# EAGLE schematic V1 (EAGLE 9.1.3)
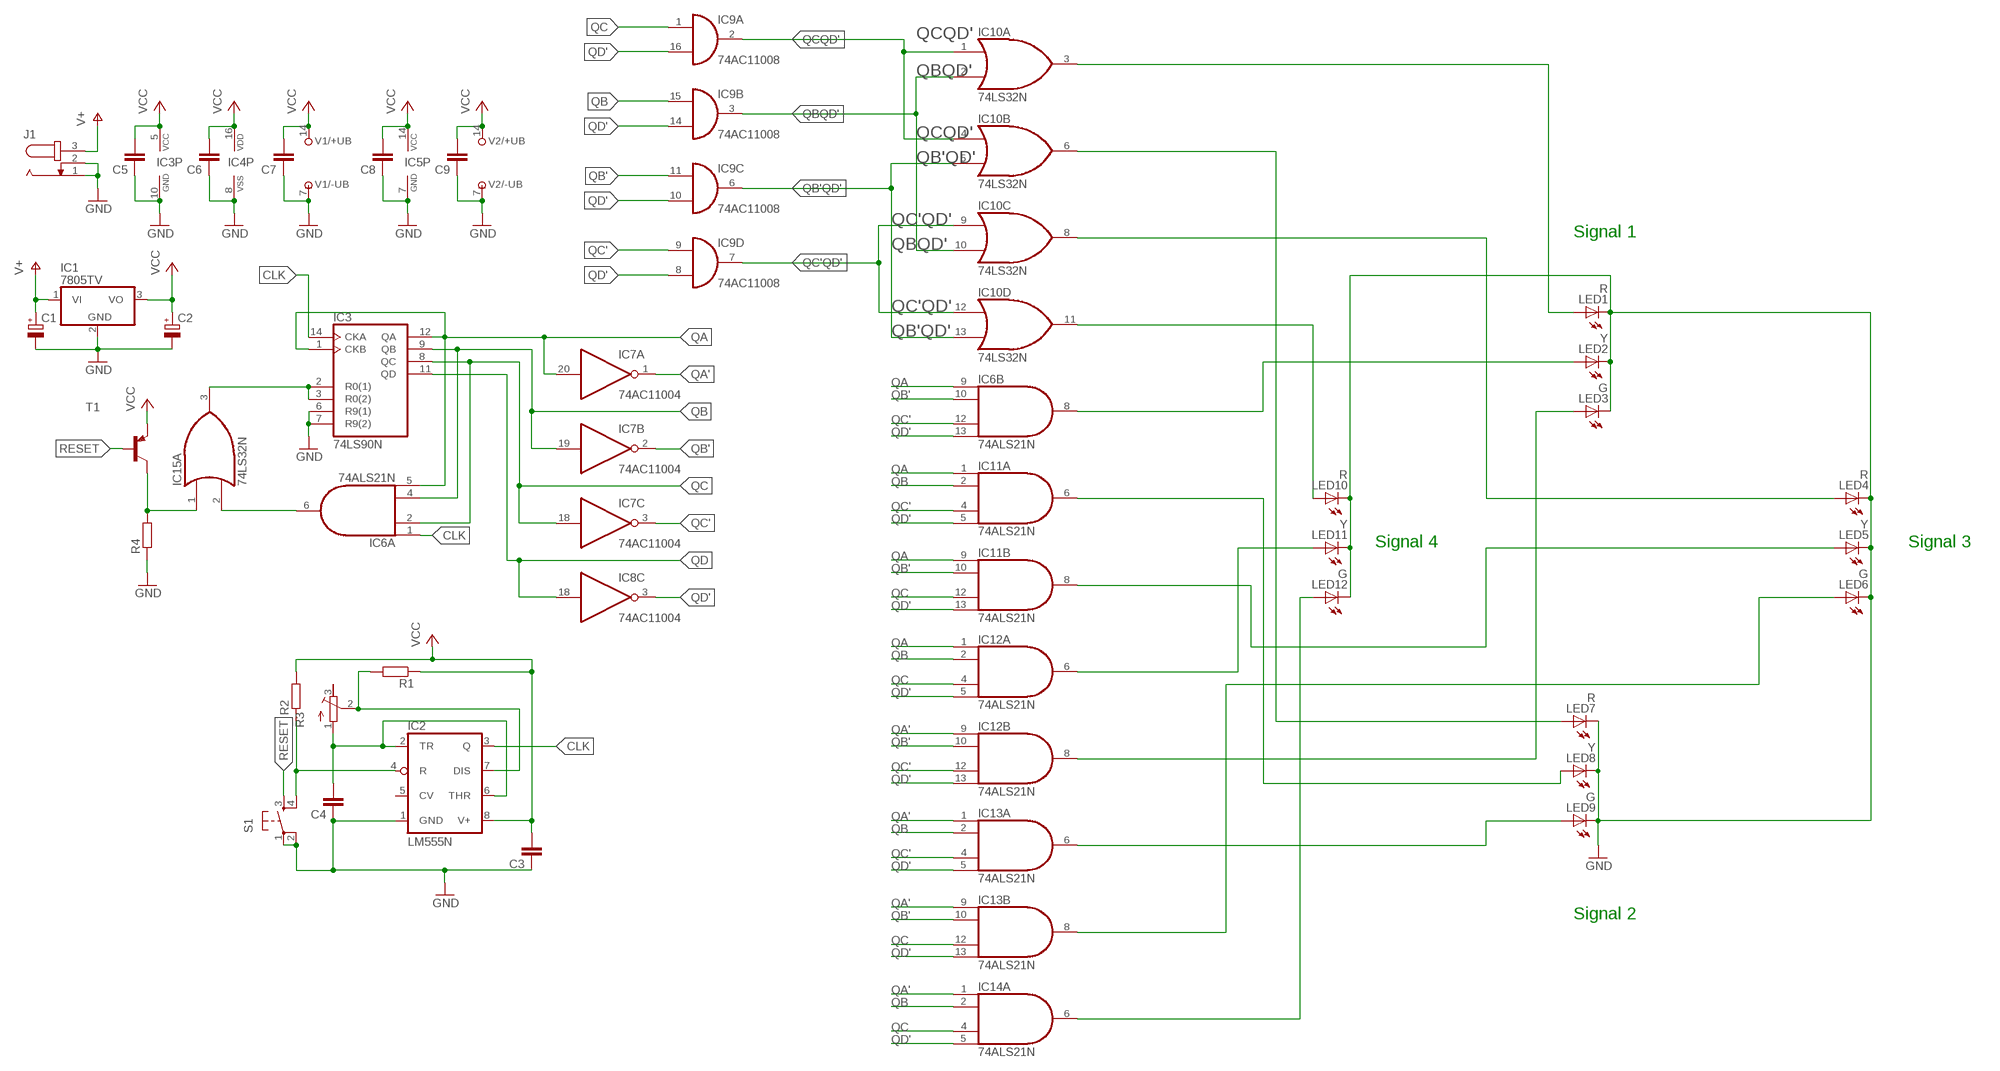
[diagram p0: schematic, sheet 1]

## Parts
C1  CPOL-EUE3.5-8  [E3,5-8]
C2  CPOL-EUE3.5-8  [E3,5-8]
C3  C-EU050-035X075  [C050-035X075]
C4  C-EU050-035X075  [C050-035X075]
C5  C-EU050-035X075  [C050-035X075]
C6  C-EU050-035X075  [C050-035X075]
C7  C-EU050-035X075  [C050-035X075]
C8  C-EU050-035X075  [C050-035X075]
C9  C-EU050-035X075  [C050-035X075]
IC1  7805TV  [TO220V]
IC2  LM555N  [DIL08]
IC3  74LS90N  [DIL14]
IC4  4028N  [DIL16]
IC5  74AC04N  [DIL14]
IC6  74ALS21N  [DIL14]
IC7  74AC11004  [DIL20]
IC8  74AC11004  [DIL20]
IC9  74AC11008  [DIL16]
IC10  74LS32N  [DIL14]
IC11  74ALS21N  [DIL14]
IC12  74ALS21N  [DIL14]
IC13  74ALS21N  [DIL14]
IC14  74ALS21N  [DIL14]
IC15  74LS32N  [DIL14]
J1  JACK-PLUG0  [SPC4077]
LED1  R  LED5MM  [LED5MM]
LED2  Y  LED5MM  [LED5MM]
LED3  G  LED5MM  [LED5MM]
LED4  R  LED5MM  [LED5MM]
LED5  Y  LED5MM  [LED5MM]
LED6  G  LED5MM  [LED5MM]
LED7  R  LED5MM  [LED5MM]
LED8  Y  LED5MM  [LED5MM]
LED9  G  LED5MM  [LED5MM]
LED10  R  LED5MM  [LED5MM]
LED11  Y  LED5MM  [LED5MM]
LED12  G  LED5MM  [LED5MM]
R1  R-EU_0207/7  [0207/7]
R2  R-EU_0207/7  [0207/7]
R3  R-TRIMM3296W  [RTRIM3296W]
R4  R-EU_0207/7  [0207/7]
S1  TAC_SWITCHPTH  [TACTILE-PTH]
T1  -PNP-TO92/  [TO92/]
V1  7432N  [DIL14]
V2  7432N  [DIL14]

## Nets
CLK: IC2.3(Q) IC3.14(CKA) IC6.1(A:I0)
GND: C1.- C2.- C3.1 C4.1 C5.1 C6.1 C7.1 C8.1 C9.1 IC1.2(GND) IC2.1(GND) IC3.6(R9(1)) IC3.7(R9(2)) IC3.10(GND) IC4.8(VSS) IC5.7(P:GND) J1.1 J1.2 LED1.K(C) LED2.K(C) LED3.K(C) LED4.K(C) LED5.K(C) LED6.K(C) LED7.K(C) LED8.K(C) LED9.K(C) LED10.K(C) LED11.K(C) LED12.K(C) R4.1 S1.1 S1.2 V1.7(/-UB:-UB) V2.7(/-UB:-UB)
N$1: IC2.4(R) R2.1 S1.4
N$2: C4.2 IC2.2(TR) IC2.6(THR) R3.1(A)
N$3: IC10.3(A:O) LED1.A
N$4: IC15.1(A:I0) R4.2 T1.3(C)
N$5: IC10.6(B:O) LED7.A
N$6: IC10.8(C:O) LED4.A
N$7: IC2.7(DIS) R1.2 R3.2(S)
N$8: IC10.11(D:O) LED10.A
N$9: IC6.8(B:O) LED2.A
N$10: IC11.6(A:O) LED8.A
N$11: IC11.8(B:O) LED5.A
N$12: IC12.6(A:O) LED11.A
N$13: IC12.8(B:O) LED3.A
N$14: IC13.6(A:O) LED9.A
N$15: IC13.8(B:O) LED6.A
N$16: IC14.6(A:O) LED12.A
N$17: IC6.6(A:O) IC15.2(A:I1)
N$18: IC3.2(R0(1)) IC3.3(R0(2)) IC15.3(A:O)
QA: IC3.1(CKB) IC3.12(QA) IC6.5(A:I3) IC6.9(B:I0) IC7.20(A:I) IC11.1(A:I0) IC11.9(B:I0) IC12.1(A:I0)
QA': IC7.1(A:O) IC12.9(B:I0) IC13.1(A:I0) IC13.9(B:I0) IC14.1(A:I0)
QB: IC3.9(QB) IC6.4(A:I2) IC7.19(B:I) IC9.15(B:I0) IC11.2(A:I1) IC12.2(A:I1) IC13.2(A:I1) IC14.2(A:I1)
QB': IC6.10(B:I1) IC7.2(B:O) IC9.11(C:I0) IC11.10(B:I1) IC12.10(B:I1) IC13.10(B:I1)
QB'QD': IC9.6(C:O) IC10.5(B:I1) IC10.13(D:I1)
QBQD': IC9.3(B:O) IC10.2(A:I1) IC10.10(C:I1)
QC: IC3.8(QC) IC6.2(A:I1) IC7.18(C:I) IC9.1(A:I0) IC11.12(B:I2) IC12.4(A:I2) IC13.12(B:I2) IC14.4(A:I2)
QC': IC6.12(B:I2) IC7.3(C:O) IC9.9(D:I0) IC11.4(A:I2) IC12.12(B:I2) IC13.4(A:I2)
QC'QD': IC9.7(D:O) IC10.9(C:I0) IC10.12(D:I0)
QCQD': IC9.2(A:O) IC10.1(A:I0) IC10.4(B:I0)
QD: IC3.11(QD) IC8.18(C:I)
QD': IC6.13(B:I3) IC8.3(C:O) IC9.8(D:I1) IC9.10(C:I1) IC9.14(B:I1) IC9.16(A:I1) IC11.5(A:I3) IC11.13(B:I3) IC12.5(A:I3) IC12.13(B:I3) IC13.5(A:I3) IC13.13(B:I3) IC14.5(A:I3)
RESET: S1.3 T1.2(B)
V+: C1.+ IC1.1(VI) J1.3
VCC: C2.+ C3.2 C5.2 C6.2 C7.2 C8.2 C9.2 IC1.3(VO) IC2.8(V+) IC3.5(VCC) IC4.16(VDD) IC5.14(P:VCC) R1.1 R2.2 T1.1(E) V1.14(/+UB:+UB) V2.14(/+UB:+UB)
Unconnected: IC2.5(CV) IC4.1(Q4) IC4.2(Q2) IC4.3(Q0) IC4.4(Q7) IC4.5(Q9) IC4.6(Q5) IC4.7(Q6) IC4.9(Q8) IC4.10(A) IC4.11(D) IC4.12(C) IC4.13(B) IC4.14(Q1) IC4.15(Q3) IC5.1(A:I) IC5.2(A:O) IC5.3(B:I) IC5.4(B:O) IC5.5(C:I) IC5.6(C:O) IC5.8(D:O) IC5.9(D:I) IC5.10(E:O) IC5.11(E:I) IC5.12(F:O) IC5.13(F:I) IC7.8(D:O) IC7.9(E:O) IC7.10(F:O) IC7.11(F:I) IC7.12(E:I) IC7.13(D:I) IC8.1(A:O) IC8.2(B:O) IC8.8(D:O) IC8.9(E:O) IC8.10(F:O) IC8.11(F:I) IC8.12(E:I) IC8.13(D:I) IC8.19(B:I) IC8.20(A:I) IC14.8(B:O) IC14.9(B:I0) IC14.10(B:I1) IC14.12(B:I2) IC14.13(B:I3) IC15.4(B:I0) IC15.5(B:I1) IC15.6(B:O) IC15.8(C:O) IC15.9(C:I0) IC15.10(C:I1) IC15.11(D:O) IC15.12(D:I0) IC15.13(D:I1) R3.3(E) V1.1(/1:A) V1.2(/1:B) V1.3(/1:Y) V1.4(/2:A) V1.5(/2:B) V1.6(/2:Y) V1.8(/3:Y) V1.9(/3:A) V1.10(/3:B) V1.11(/4:Y) V1.12(/4:A) V1.13(/4:B) V2.1(/1:A) V2.2(/1:B) V2.3(/1:Y) V2.4(/2:A) V2.5(/2:B) V2.6(/2:Y) V2.8(/3:Y) V2.9(/3:A) V2.10(/3:B) V2.11(/4:Y) V2.12(/4:A) V2.13(/4:B)

## Notes on the sheet
- Signal 1
- Signal 4 | Signal 3
- Signal 2

## Power pins joined to a net without a drawn wire
GND: IC6.7(P:GND) IC7.4(P:GND) IC7.5(P:GND) IC7.6(P:GND) IC7.7(P:GND) IC8.4(P:GND) IC8.5(P:GND) IC8.6(P:GND) IC8.7(P:GND) IC9.4(P:GND) IC9.5(P:GND) IC10.7(P:GND) IC11.7(P:GND) IC12.7(P:GND) IC13.7(P:GND) IC14.7(P:GND) IC15.7(P:GND)
VCC: IC6.14(P:VCC) IC7.15(P:VCC) IC7.16(P:VCC) IC8.15(P:VCC) IC8.16(P:VCC) IC9.12(P:VCC) IC9.13(P:VCC) IC10.14(P:VCC) IC11.14(P:VCC) IC12.14(P:VCC) IC13.14(P:VCC) IC14.14(P:VCC) IC15.14(P:VCC)

## Library data of the parts
C1 C2 = rcl:CPOL-EU: POLARIZED CAPACITOR, European symbol; SPICEPREFIX: C
C3-C9 = rcl:C-EU: CAPACITOR, European symbol; SPICEPREFIX: C
IC1 = linear:78*: Positive VOLTAGE REGULATOR Source: http://cache.national.com/ds/LM/LM78L05.pdf http://www.fairchildsemi.com/ds/LM/LM7805.pdf
IC2 = linear:*555: TIMER
IC3 = 74xx-eu:74*90: Decade, divide by twelve and binary COUNTER
IC4 = 40xx:4028: BCD to decimal DECODER
IC5 = 74xx-eu:74*04: Hex INVERTER
IC6 IC11-IC14 = 74xx-us:74*21: Dual 4-input AND gate
IC7 IC8 = 74ac-logic:74AC11004: Hex INVERTER
IC9 = 74ac-logic:74AC11008: Quadruple 2-input AND
IC10 IC15 = 74xx-us:74*32: Quad 2-input OR gate
J1 = con-jack:JACK-PLUG: DC POWER JACK Power Jack, DC, Right Angle, Through Hole, Rated 5A at 16VDC, PC Terminals Distributor: Farnell (www.Farnell.de) Drawing: 84N1161.pdf / 84N1162.pdf Manufacturer: SPC Technology (www.spctechnology.com) Type: SPC4077 / SPC 4078; OC_FARNELL: unknown; OC_NEWARK: unknown
LED1-LED12 = led:LED: LED OSRAM: - CHIPLED LG R971, LG N971, LY N971, LG Q971, LY Q971, LO R971, LY R971 LH N974, LH R974 LS Q976, LO Q976, LY Q976 LO Q996 - Hyper CHIPLED LW Q18S LB Q993, LB Q99A, LB R99A - SideLED LS A670, LO A670, LY A670, LG A670, LP A670 LB A673, LV A673, LT A673, LW A673 LH A674 LY A675 LS A676, LA A676, LO A676, LY A676, LW A676 LS A679, LY A679, LG A679 - Hyper Micro SIDELED® LS Y876, LA Y876, LO Y876, LY Y876 LT Y87S - SmartLED LW L88C, LW L88S LB L89C, LB L89S, LG L890 LS L89K, LO L89K, LY L89K LS L896, LA L896, LO L896, LY L896 - TOPLED LS T670, LO T670, LY T670, LG T670, LP T670 LSG T670, LSP T670, LSY T670, LOP T670, LYG T670 LG T671, LOG T671, LSG T671 LB T673, LV T673, LT T673, LW T673 LH T674 LS T676, LA T676, LO T676, LY T676, LB T676, LH T676, LSB T676, LW T676 LB T67C, LV T67C, LT T67C, LS T67K, LO T67K, LY T67K, LW E67C LS E67B, LA E67B, LO E67B, LY E67B, LB E67C, LV E67C, LT E67C LW T67C LS T679, LY T679, LG T679 LS T770, LO T770, LY T770, LG T770, LP T770 LB T773, LV T773, LT T773, LW T773 LH T774 LS E675, LA E675, LY E675, LS T675 LS T776, LA T776, LO T776, LY T776, LB T776 LHGB T686 LT T68C, LB T68C - Hyper Mini TOPLED® LB M676 - Mini TOPLED Santana® LG M470 LS M47K, LO M47K, LY M47K Source: http://www.osram.convergy.de LUXEON: - LUMILED® LXK2-PW12-R00, LXK2-PW12-S00, LXK2-PW14-U00, LXK2-PW14-V00 LXK2-PM12-R00, LXK2-PM12-S00, LXK2-PM14-U00 LXK2-PE12-Q00, LXK2-PE12-R00, LXK2-PE12-S00, LXK2-PE14-T00, LXK2-PE14-U00 LXK2-PB12-K00, LXK2-PB12-L00, LXK2-PB12-M00, LXK2-PB14-N00, LXK2-PB14-P00, LXK2-PB14-Q00 LXK2-PR12-L00, LXK2-PR12-M00, LXK2-PR14-Q00, LXK2-PR14-R00 LXK2-PD12-Q00, LXK2-PD12-R00, LXK2-PD12-S00 LXK2-PH12-R00, LXK2-PH12-S00 LXK2-PL12-P00, LXK2-PL12-Q00, LXK2-PL12-R00 Source: www.luxeon.com KINGBRIGHT: KA-3528ASYC Source: www.kingbright.com
R1 R2 R4 = rcl:R-EU_: RESISTOR, European symbol; SPICEPREFIX: R
R3 = rcl:R-TRIMM: Trimm resistor; SPICEMODEL: X; SPICEPREFIXL: POT
S1 = SparkFun-Retired:TAC_SWITCH: Momentary Switch Button commonly used for reset or general input. Spark Fun Electronics SKU : COM-00097 SMT- SWCH-08247
T1 = transistor:*-PNP-: PNP Transistror
V1 V2 = 74ttl-din:74*32: Quad 2-input OR gate